# EAGLE board Wheelchair (EAGLE 5.11), part 1 of 2
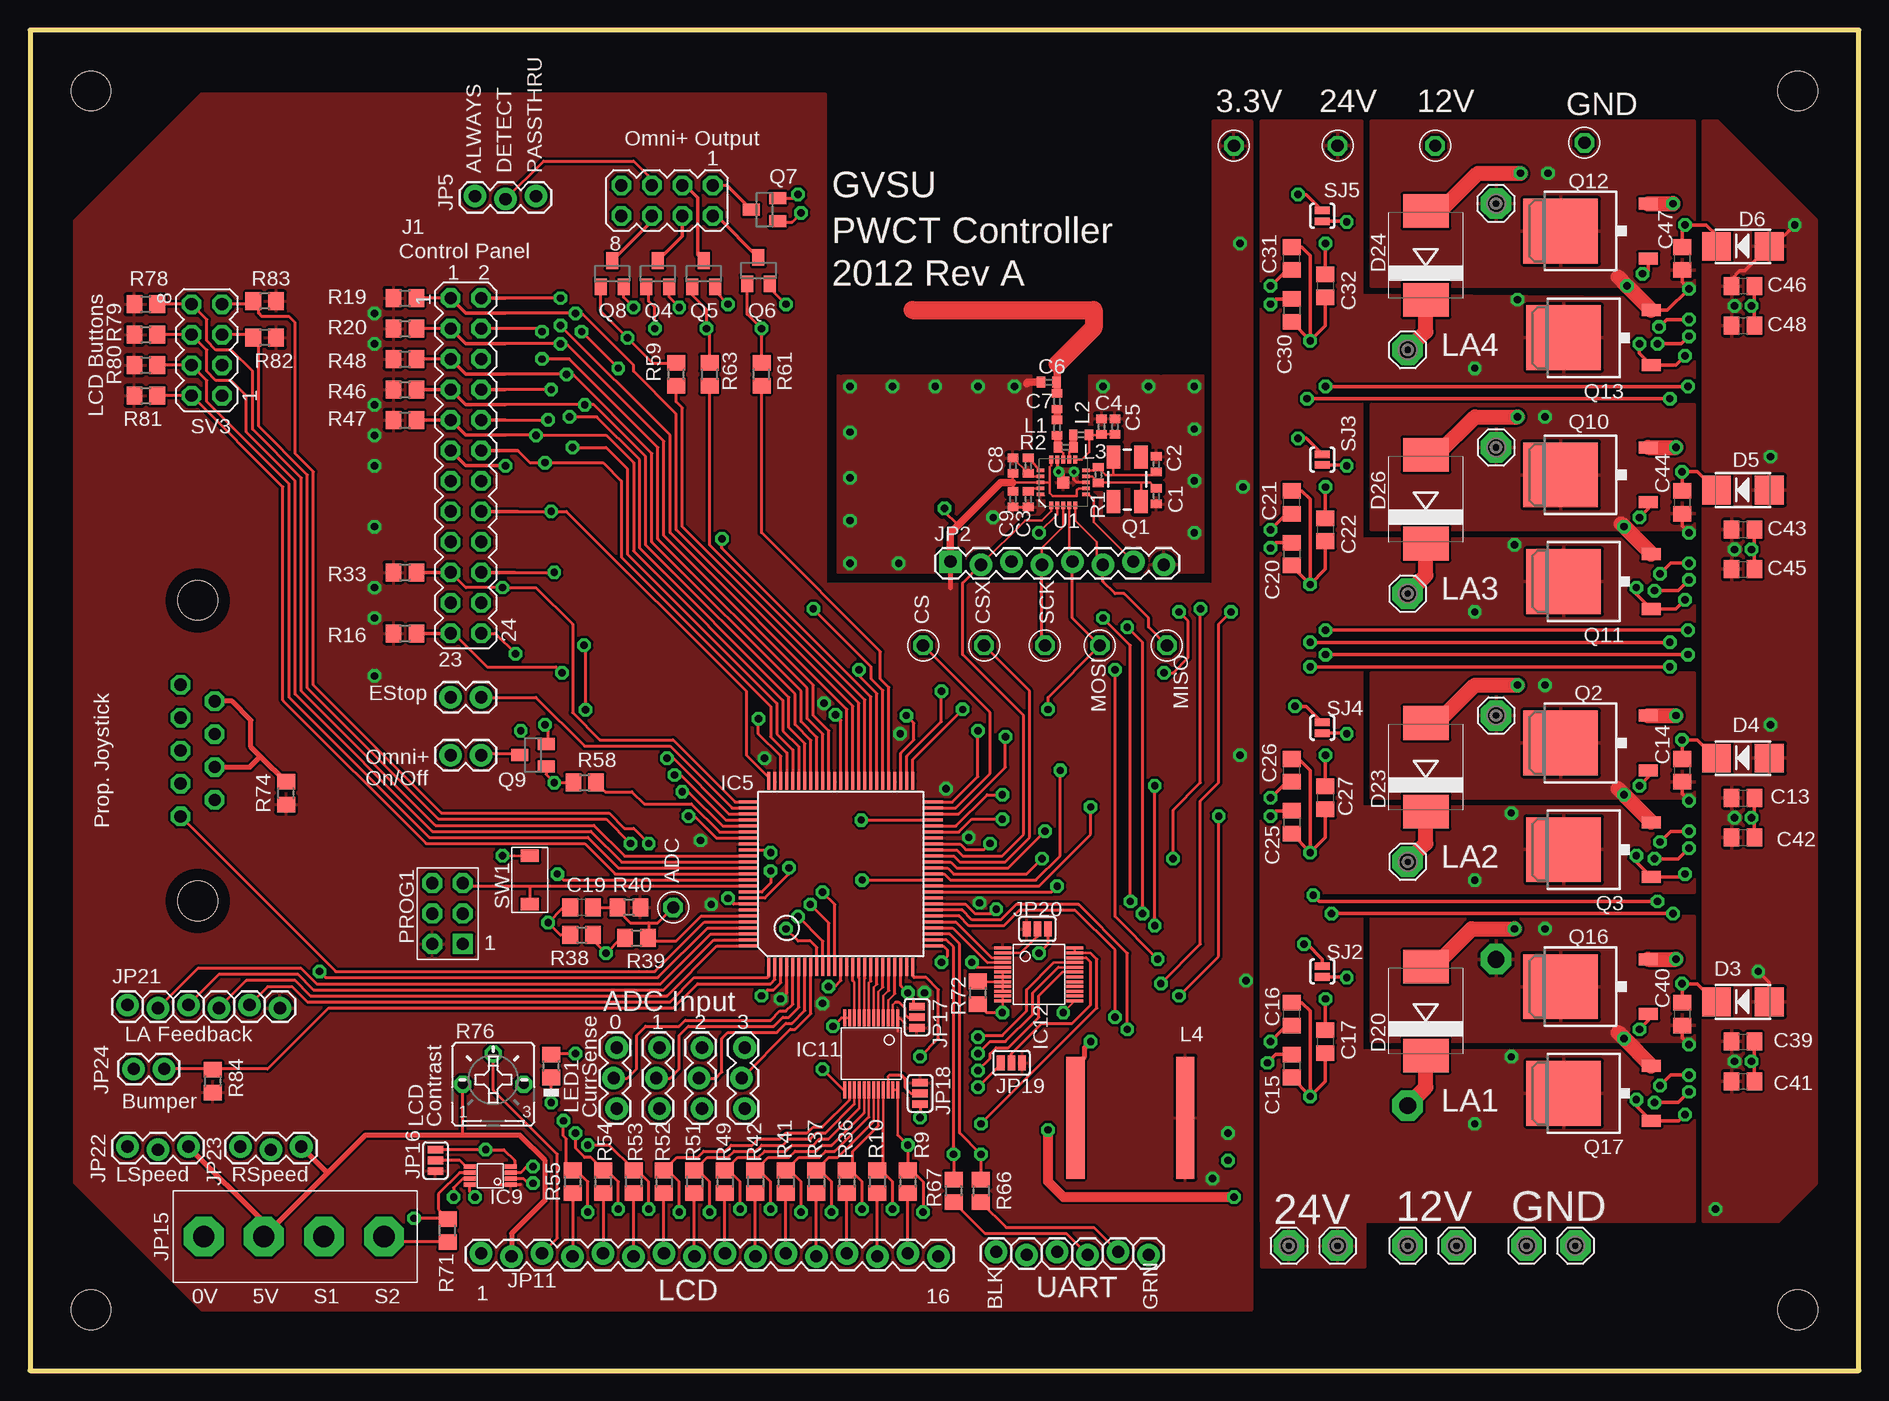
[diagram p3: board, top side]
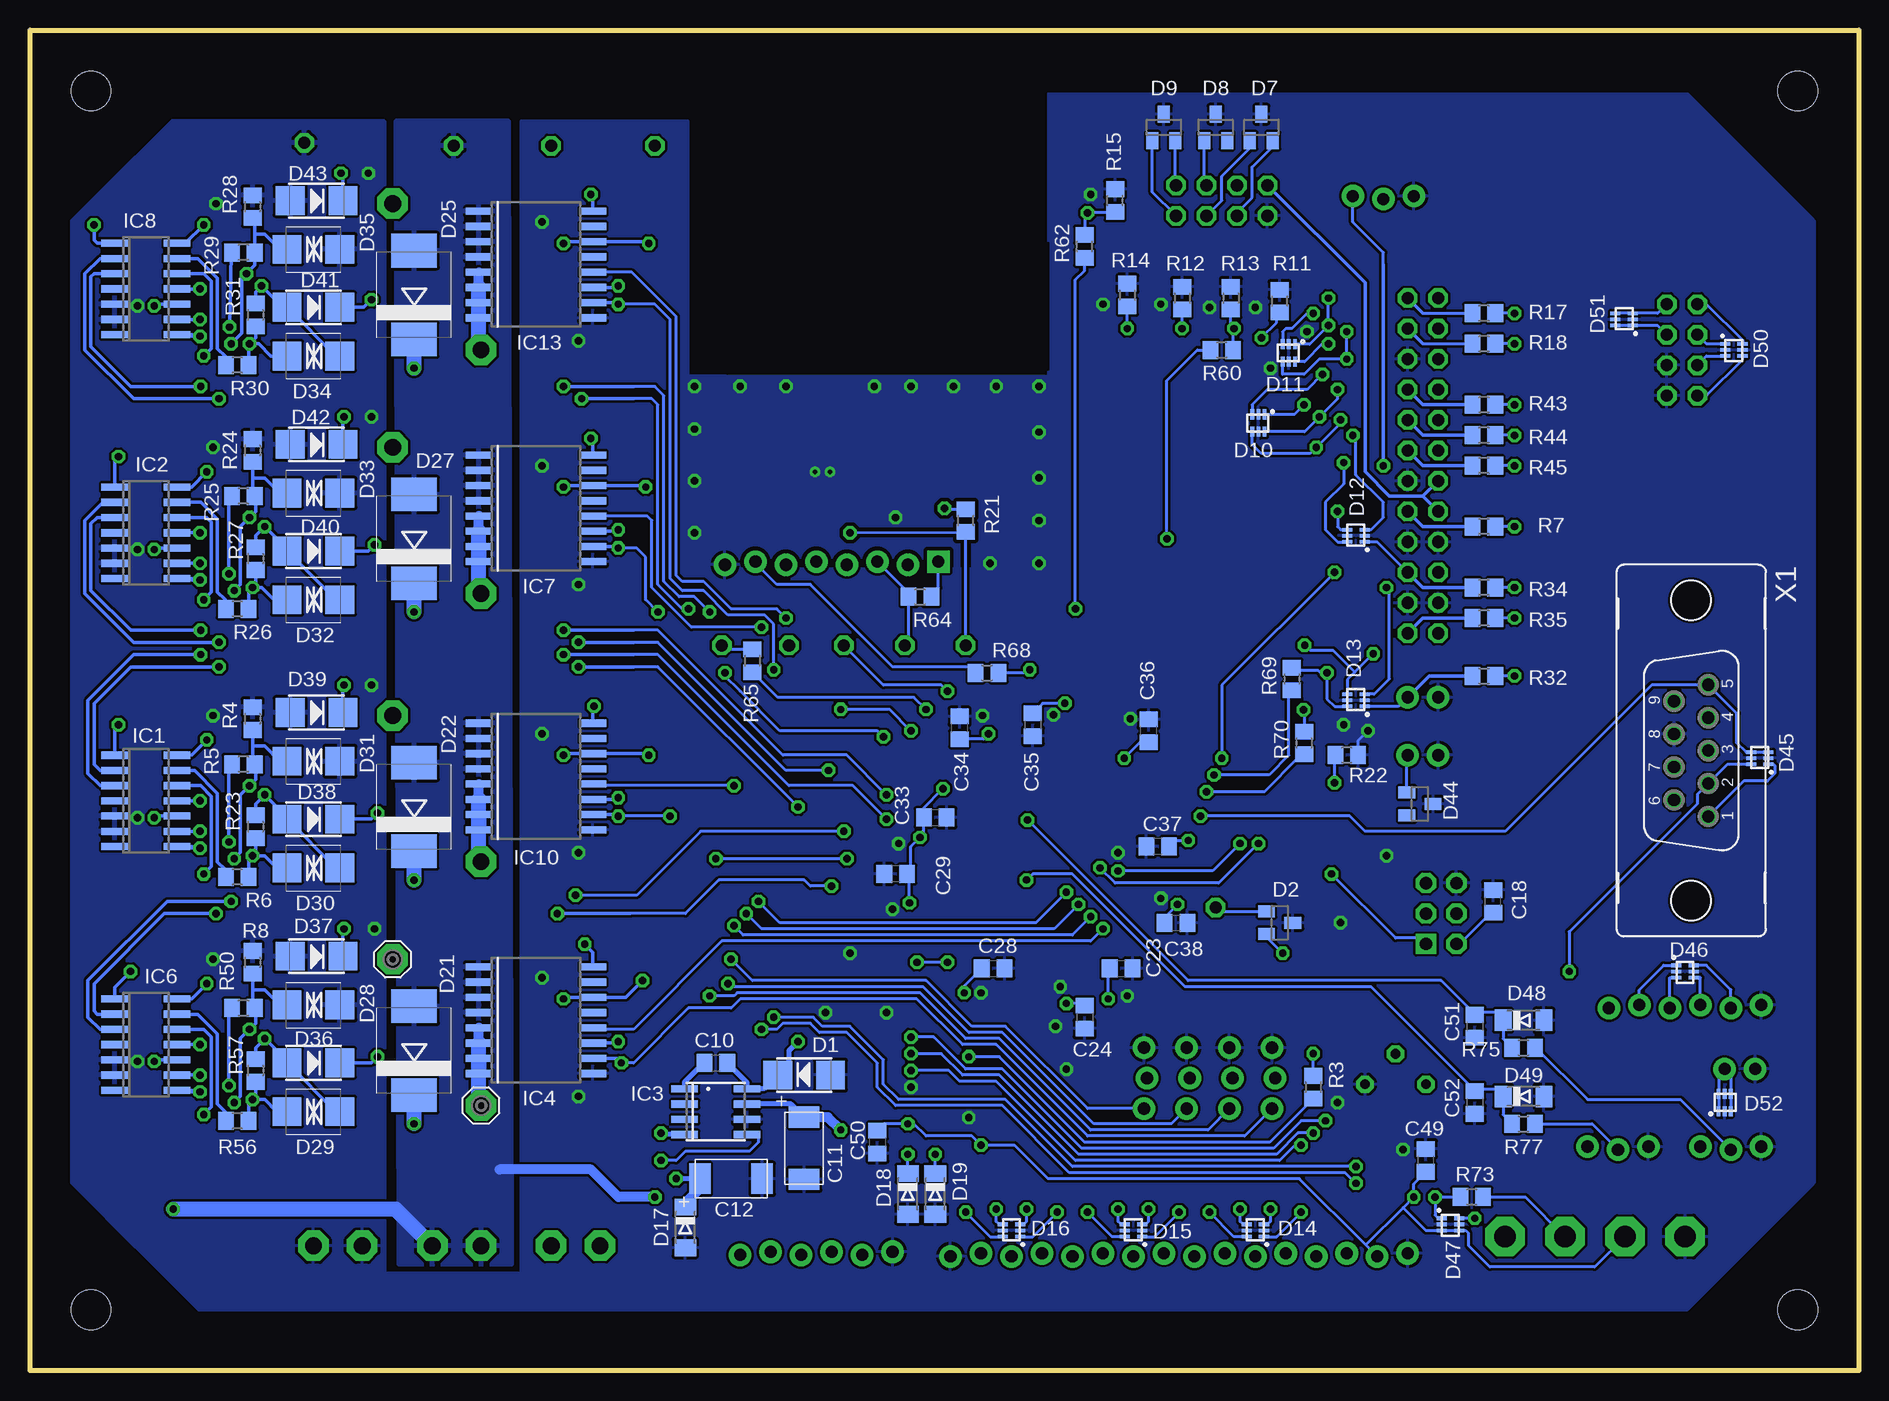
[diagram p4: board, bottom side, seen from below]

Size 152.4 x 111.76 mm. Coordinates in mm from the lower left corner, seen from the top.
Outline: 0,0 152.4,0 152.4,111.76 0,111.76 0,0
Copper layers (1*16): Top 0.035mm / dielectric 1.5mm / Bottom 0.035mm
Design rules "SparkFunmod": minimum track width 8mil, minimum drill 20mil, track to track 8mil, track to pad 8mil, pad to pad 8mil, via to via 8mil, smd to smd 8mil, copper to edge 10mil, drill to drill 8mil, minimum pad ring 12mil, minimum via ring 10mil, stop-mask expansion 4mil, vias tented up to drill 0mil, thermal gap 10mil
tRestrict: area 67.6,83.4 to 94.2,94; area 3.6,4.8 to 14.2,15.5; area 3.6,96 to 14.2,106.7; area 138.4,96 to 149.1,106.7; area 138.4,4.8 to 149.1,15.5
bRestrict: area 67.6,83.4 to 94.2,94; area 3.6,4.8 to 14.2,15.5; area 3.6,96 to 14.2,106.7; area 138.4,96 to 149.1,106.7; area 138.4,4.8 to 149.1,15.5

## Footprints (pad centres in the part's own frame; a part is rotated, then mirrored left to right if it is on the bottom)
C0402 = smd 0.7 x 0.9: 1 -0.65,0; 2 0.65,0
C0805 = smd 1.3 x 1.5: 1 -0.95,0; 2 0.95,0
CPOL2312 = smd 1.778 x 2.54: + -2.591,0; - 2.591,0
SMA = smd 2.4 x 2.4: A 2.2,0; C -2.2,0
SOT-23 = smd 1 x 1.4: 1 -0.95,-1.1; 2 0.95,-1.1; 3 0,1.1
SOT23 = smd 1 x 1.4: 1 -0.95,-1.1; 2 0.95,-1.1; 3 0,1.1
SC89 = smd 0.305 x 0.838: 1 -0.508,-0.724; 2 0,-0.724; 3 0.508,-0.724; 4 0.508,0.724; 5 0,0.724; 6 -0.508,0.724
MINIMELF = smd 1.4 x 1.8: A 1.7,0; C -1.7,0
SMC = smd 2.8 x 3.8: A 3.7,0; C -3.7,0
SMBBI = smd 2.4 x 2.4: A 2.2,0; K -2.2,0
SO14 = smd 0.6 x 2.2: 1 -3.81,-2.6; 2 -2.54,-2.6; 3 -1.27,-2.6; 4 0,-2.6; 5 1.27,-2.6; 6 2.54,-2.6; 7 3.81,-2.6; 8 3.81,2.6; 9 2.54,2.6; 10 1.27,2.6; 11 0,2.6; 12 -1.27,2.6; 13 -2.54,2.6; 14 -3.81,2.6
SOIC8_3.9MM = smd 0.6 x 2.2: 1 -1.905,-2.6; 2 -0.635,-2.6; 3 0.635,-2.6; 4 1.905,-2.6; 5 1.905,2.6; 6 0.635,2.6; 7 -0.635,2.6; 8 -1.905,2.6
SOIC16W = smd 0.6 x 2.2: 1 -4.445,-4.75; 2 -3.175,-4.75; 3 -1.905,-4.75; 4 -0.635,-4.75; 5 0.635,-4.75; 6 1.905,-4.75; 7 3.175,-4.75; 8 4.445,-4.75; 9 4.445,4.75; 10 3.175,4.75; 11 1.905,4.75; 12 0.635,4.75; 13 -0.635,4.75; 14 -1.905,4.75; 15 -3.175,4.75; 16 -4.445,4.75
TQFP100 = smd 0.27 x 1.5: 1 -6,-7.75; 2 -5.5,-7.75; 3 -5,-7.75; 4 -4.5,-7.75; 5 -4,-7.75; 6 -3.5,-7.75; 7 -3,-7.75; 8 -2.5,-7.75; 9 -2,-7.75; 10 -1.5,-7.75; 11 -1,-7.75; 12 -0.5,-7.75; 13 0,-7.75; 14 0.5,-7.75; 15 1,-7.75; 16 1.5,-7.75; 17 2,-7.75; 18 2.5,-7.75; 19 3,-7.75; 20 3.5,-7.75; 21 4,-7.75; 22 4.5,-7.75; 23 5,-7.75; 24 5.5,-7.75; 25 6,-7.75; 51 6,7.75; 52 5.5,7.75; 53 5,7.75; 54 4.5,7.75; 55 4,7.75; 56 3.5,7.75; 57 3,7.75; 58 2.5,7.75; 59 2,7.75; 60 1.5,7.75; 61 1,7.75; 62 0.5,7.75; 63 0,7.75; 64 -0.5,7.75; 65 -1,7.75; 66 -1.5,7.75; 67 -2,7.75; 68 -2.5,7.75; 69 -3,7.75; 70 -3.5,7.75; 71 -4,7.75; 72 -4.5,7.75; 73 -5,7.75; 74 -5.5,7.75; 75 -6,7.75 | smd 1.5 x 0.27: 26 7.75,-6; 27 7.75,-5.5; 28 7.75,-5; 29 7.75,-4.5; 30 7.75,-4; 31 7.75,-3.5; 32 7.75,-3; 33 7.75,-2.5; 34 7.75,-2; 35 7.75,-1.5; 36 7.75,-1; 37 7.75,-0.5; 38 7.75,0; 39 7.75,0.5; 40 7.75,1; 41 7.75,1.5; 42 7.75,2; 43 7.75,2.5; 44 7.75,3; 45 7.75,3.5; 46 7.75,4; 47 7.75,4.5; 48 7.75,5; 49 7.75,5.5; 50 7.75,6; 76 -7.75,6; 77 -7.75,5.5; 78 -7.75,5; 79 -7.75,4.5; 80 -7.75,4; 81 -7.75,3.5; 82 -7.75,3; 83 -7.75,2.5; 84 -7.75,2; 85 -7.75,1.5; 86 -7.75,1; 87 -7.75,0.5; 88 -7.75,0; 89 -7.75,-0.5; 90 -7.75,-1; 91 -7.75,-1.5; 92 -7.75,-2; 93 -7.75,-2.5; 94 -7.75,-3; 95 -7.75,-3.5; 96 -7.75,-4; 97 -7.75,-4.5; 98 -7.75,-5; 99 -7.75,-5.5; 100 -7.75,-6
VSSOP8 = smd 0.35 x 1: 1 -0.75,-1.7; 2 -0.25,-1.7; 3 0.25,-1.7; 4 0.75,-1.7; 5 0.75,1.7; 6 0.25,1.7; 7 -0.25,1.7; 8 -0.75,1.7
TVSOP24 = smd 0.25 x 1.4: 1 -2.2,-3; 2 -1.8,-3; 3 -1.4,-3; 4 -1,-3; 5 -0.6,-3; 6 -0.2,-3; 7 0.2,-3; 8 0.6,-3; 9 1,-3; 10 1.4,-3; 11 1.8,-3; 12 2.2,-3; 13 2.2,3; 14 1.8,3; 15 1.4,3; 16 1,3; 17 0.6,3; 18 0.2,3; 19 -0.2,3; 20 -0.6,3; 21 -1,3; 22 -1.4,3; 23 -1.8,3; 24 -2.2,3
1X06_LOCK = drill 1.016 pad 1.88 round: 1 0,0; 2 2.54,-0.254; 3 5.08,0; 4 7.62,-0.254; 5 10.16,0; 6 12.7,-0.254
1X08_LOCK = drill 1.016 pad 1.88 square: 1 0,0.127 | drill 1.016 pad 1.88 round: 2 2.54,-0.127; 3 5.08,0.127; 4 7.62,-0.127; 5 10.16,0.127; 6 12.7,-0.127; 7 15.24,0.127; 8 17.78,-0.127
1X02 = drill 1.016 pad 1.88 round: 1 0,0; 2 2.54,0
1X03_LOCK = drill 1.016 pad 1.88 round: 1 0,0.127; 2 2.54,-0.127; 3 5.08,0.127
STAND-OFF = hole 3.302: 0,0
1X16_LOCK = drill 1.016 pad 1.88 round: 1 0,0.127; 2 2.54,-0.127; 3 5.08,0.127; 4 7.62,-0.127; 5 10.16,0.127; 6 12.7,-0.127; 7 15.24,0.127; 8 17.78,-0.127; 9 20.32,0.127; 10 22.86,-0.127; 11 25.4,0.127; 12 27.94,-0.127; 13 30.48,0.127; 14 33.02,-0.127; 15 35.56,0.127; 16 38.1,-0.127
4PINH0.197 = drill 1.778 pad 3.302 octagon: P$1 0,0; P$2 5.004,0; P$3 10.008,0; P$4 15.011,0
SJ_3 = smd 0.635 x 1.27: 1 -0.889,0; 2 0,0; 3 0.889,0
LCI_SERIES_PULSE_EGR = smd 1.524 x 10.16: P$1 4.572,0; P$2 -4.572,0
D0805 = smd 1.3 x 1.5: A 0.95,0; C -0.95,0
SE14 = drill 1.397 pad 2.54 octagon: MP 0,0
CON6P2R = drill 1.016 pad 1.676 square: 1 -2.54,-1.27 | drill 1.016 pad 1.676 octagon: 2 -2.54,1.27; 3 0,-1.27; 4 0,1.27; 5 2.54,-1.27; 6 2.54,1.27
CRYSTAL-SMD-5X3 = smd 1.9 x 1.1: 1 -1.85,-1.15; 2 1.85,-1.15; 3 1.85,1.15; 4 -1.85,1.15
TO252 = smd 1 x 1.6: 1 -2.28,-4.8; 2 2.28,-4.8 | smd 5.4 x 6.2: 3 0,2.5
R0805 = smd 1.3 x 1.5: 1 -0.95,0; 2 0.95,0
B25P = drill 0.813 octagon: A -2.54,0; E 2.54,0; S 0,2.54
SJ_2S-NO = smd 0.635 x 1.27: 1 -0.45,0; 2 0.45,0
MA12-2 = drill 1.016 octagon: 1 -13.97,-1.27; 2 -13.97,1.27; 3 -11.43,-1.27; 4 -11.43,1.27; 5 -8.89,-1.27; 6 -8.89,1.27; 7 -6.35,-1.27; 8 -6.35,1.27; 9 -3.81,-1.27; 10 -3.81,1.27; 11 -1.27,-1.27; 12 -1.27,1.27; 13 1.27,-1.27; 14 1.27,1.27; 15 3.81,-1.27; 16 3.81,1.27; 17 6.35,-1.27; 18 6.35,1.27; 19 8.89,-1.27; 20 8.89,1.27; 21 11.43,-1.27; 22 11.43,1.27; 23 13.97,-1.27; 24 13.97,1.27
MA04-2 = drill 1.016 octagon: 1 -3.81,-1.27; 2 -3.81,1.27; 3 -1.27,-1.27; 4 -1.27,1.27; 5 1.27,-1.27; 6 1.27,1.27; 7 3.81,-1.27; 8 3.81,1.27
TL1015 = smd 1.05 x 1.5: P$1 2.025,0; P$2 -2.025,0
TP40MIL = drill 1.016 octagon: 1 0,0
QFN20 = smd 1 x 1: 0 0,0 | smd 0.65 x 0.3: 1 -1.9,1; 2 -1.9,0.5; 3 -1.9,0; 4 -1.9,-0.5; 5 -1.9,-1; 11 1.9,-1; 12 1.9,-0.5; 13 1.9,0; 14 1.9,0.5; 15 1.9,1 | smd 0.3 x 0.65: 6 -1,-1.9; 7 -0.5,-1.9; 8 0,-1.9; 9 0.5,-1.9; 10 1,-1.9; 16 1,1.9; 17 0.5,1.9; 18 0,1.9; 19 -0.5,1.9; 20 -1,1.9
F09V = drill 1.016 octagon: 1 5.486,1.422; 2 2.743,1.422; 3 0,1.422; 4 -2.743,1.422; 5 -5.486,1.422; 6 4.115,-1.422; 7 1.372,-1.422; 8 -1.372,-1.422; 9 -4.115,-1.422 | hole 3.302: -12.522,0; 12.522,0

## Placement (x,y rotation side)
C1  22pF  [C0402]  93.85,72.9 270 top
C2  22pF  [C0402]  93.85,75.57 90 top
C3  33nF  [C0402]  83.19,72.64 270 top
C4  2.2nF  [C0402]  89.3,78.7 90 top
C5  4.7pF  [C0402]  90.41,78.7 90 top
C6  1.0pF  [C0402]  84.91,82.4 0 top
C7  1.5pF  [C0402]  85.59,80.81 90 top
C8  10nF  [C0402]  81.91,75.44 270 top
C9  1nF  [C0402]  81.91,72.64 90 top
C10  0.01uF  [C0805]  95.25,25.65 0 bottom
C11  100uF  [CPOL2312]  87.88,18.54 270 bottom
C12  100uF  [CPOL2312]  93.98,16 0 bottom
C13  10uF  [C0805]  142.75,47.75 0 top
C14  1uF  [C0805]  137.67,50.04 270 top
C15  1nF  [C0805]  105.16,25.4 270 top
C16  10nF  [C0805]  105.16,29.72 90 top
C17  0.1uF  [C0805]  107.95,27.43 270 top
C18  0.1uF  [C0805]  30.48,39.12 90 bottom
C19  0.1uF  [C0805]  45.97,38.61 180 top
C20  1nF  [C0805]  105.16,68.07 270 top
C21  10nF  [C0805]  105.16,72.39 90 top
C22  0.1uF  [C0805]  107.95,70.1 270 top
C23  0.1uF  [C0805]  61.47,33.53 0 bottom
C24  0.1uF  [C0805]  64.52,29.46 270 bottom
C25  1nF  [C0805]  105.16,45.72 270 top
C26  10nF  [C0805]  105.16,50.04 90 top
C27  0.1uF  [C0805]  107.95,47.75 270 top
C28  0.1uF  [C0805]  72.14,33.53 0 bottom
C29  0.1uF  [C0805]  80.26,41.4 180 bottom
C30  1nF  [C0805]  105.16,88.39 270 top
C31  10nF  [C0805]  105.16,92.71 90 top
C32  0.1uF  [C0805]  107.95,90.42 270 top
C33  0.1uF  [C0805]  76.96,46.1 0 bottom
C34  0.1uF  [C0805]  74.93,53.59 90 bottom
C35  0.1uF  [C0805]  68.83,53.85 270 bottom
C36  0.1uF  [C0805]  59.18,53.34 90 bottom
C37  0.1uF  [C0805]  58.42,43.69 180 bottom
C38  0.1uF  [C0805]  56.9,37.34 0 bottom
C39  10uF  [C0805]  142.75,27.43 0 top
C40  1uF  [C0805]  137.67,29.72 270 top
C41  0.1uF  [C0805]  142.75,24.13 0 top
C42  0.1uF  [C0805]  142.75,44.45 0 top
C43  10uF  [C0805]  142.75,70.1 0 top
C44  1uF  [C0805]  137.67,72.39 270 top
C45  0.1uF  [C0805]  142.75,66.8 0 top
C46  10uF  [C0805]  142.75,90.42 0 top
C47  1uF  [C0805]  137.67,92.71 270 top
C48  0.1uF  [C0805]  142.75,87.12 0 top
C49  0.1uF  [C0805]  36.07,17.53 90 bottom
C50  0.1uF  [C0805]  81.79,19.05 270 bottom
C51  1nF  [C0805]  32,28.7 270 bottom
C52  1nF  [C0805]  32,22.35 270 bottom
D1  [SMA]  87.88,24.64 0 bottom
D2  TL431SOT23  [SOT-23]  48.26,37.34 270 bottom
D3  [SMA]  142.75,30.73 0 top
D4  [SMA]  142.75,51.05 0 top
D5  [SMA]  142.75,73.41 0 top
D6  [SMA]  142.75,93.73 0 top
D7  ZENER_COMMON_ANODE  [SOT23]  49.78,103.63 0 bottom
D8  ZENER_COMMON_ANODE  [SOT23]  53.59,103.63 0 bottom
D9  ZENER_COMMON_ANODE  [SOT23]  57.91,103.63 0 bottom
D10  TVS4  [SC89]  50.04,78.99 180 bottom
D11  TVS4  [SC89]  47.5,84.84 180 bottom
D12  TVS4  [SC89]  41.91,69.6 90 bottom
D13  TVS4  [SC89]  41.91,55.88 90 bottom
D14  TVS4  [SC89]  50.29,11.68 90 bottom
D15  TVS4  [SC89]  60.45,11.68 90 bottom
D16  TVS4  [SC89]  70.61,11.68 90 bottom
D17  3.3V  [MINIMELF]  97.79,11.94 270 bottom
D18  3.3V  [MINIMELF]  79.25,14.73 270 bottom
D19  3.3V  [MINIMELF]  76.96,14.73 270 bottom
D20  [SMC]  116.33,29.97 90 top
D21  [SMC]  120.4,26.67 90 bottom
D22  [SMC]  120.4,46.99 90 bottom
D23  [SMC]  116.33,50.29 90 top
D24  [SMC]  116.33,92.96 90 top
D25  [SMC]  120.4,89.66 90 bottom
D26  [SMC]  116.33,72.64 90 top
D27  [SMC]  120.4,69.34 90 bottom
D28  [SMBBI]  128.78,30.48 0 bottom
D29  [SMBBI]  128.78,21.59 0 bottom
D30  [SMBBI]  128.78,41.91 0 bottom
D31  [SMBBI]  128.78,50.8 0 bottom
D32  [SMBBI]  128.78,64.26 0 bottom
D33  [SMBBI]  128.78,73.15 0 bottom
D34  [SMBBI]  128.78,84.58 0 bottom
D35  [SMBBI]  128.78,93.47 0 bottom
D36  TVSSMA  [SMA]  128.78,25.65 180 bottom
D37  TVSSMA  [SMA]  128.52,34.54 180 bottom
D38  TVSSMA  [SMA]  128.78,45.97 180 bottom
D39  TVSSMA  [SMA]  128.52,54.86 180 bottom
D40  TVSSMA  [SMA]  128.78,68.33 180 bottom
D41  TVSSMA  [SMA]  128.78,88.65 180 bottom
D42  TVSSMA  [SMA]  128.52,77.22 180 bottom
D43  TVSSMA  [SMA]  128.52,97.54 180 bottom
D44  ZENER_COMMON_ANODE  [SOT23]  36.58,47.24 270 bottom
D45  TVS4  [SC89]  8.26,51.05 90 bottom
D46  TVS4  [SC89]  14.48,33.27 270 bottom
D47  TVS4  [SC89]  34.04,12.19 270 bottom
D48  3.3V  [MINIMELF]  27.94,29.21 0 bottom
D49  3.3V  [MINIMELF]  27.94,22.86 0 bottom
D50  TVS4  [SC89]  10.41,85.09 270 bottom
D51  TVS4  [SC89]  19.56,87.63 90 bottom
D52  TVS4  [SC89]  11.18,22.35 0 bottom
IC1  LT1160  [SO14]  142.75,47.5 270 bottom
IC2  LT1160  [SO14]  142.75,69.85 270 bottom
IC3  LM2674M  [SOIC8_3.9MM]  95.25,21.59 270 bottom
IC4  ACS716  [SOIC16W]  110.24,29.21 270 bottom
IC5  ATXMEGA_A1  [TQFP100]  67.56,41.4 0 top
IC6  LT1160  [SO14]  142.75,27.18 270 bottom
IC7  ACS716  [SOIC16W]  110.24,71.88 270 bottom
IC8  LT1160  [SO14]  142.75,90.17 270 bottom
IC9  74LVC2T45  [VSSOP8]  38.35,16.26 90 top
IC10  ACS716  [SOIC16W]  110.24,49.53 270 bottom
IC11  SN74LVC8T245DGVR  [TVSOP24]  70.1,26.42 180 top
IC12  SN74LVC8T245DGVR  [TVSOP24]  84.07,33.02 270 top
IC13  ACS716  [SOIC16W]  110.24,92.2 270 bottom
JP1  [1X06_LOCK]  80.52,9.91 0 top
JP2  [1X08_LOCK]  76.71,67.31 0 top
JP3  [1X02]  37.59,56.13 180 top
JP4  [1X02]  37.59,51.31 180 top
JP5  [1X03_LOCK]  37.08,97.79 0 top
JP6  [1X03_LOCK]  48.77,26.92 270 top
JP7  [1X03_LOCK]  52.32,26.92 270 top
JP8  [1X03_LOCK]  55.88,26.92 270 top
JP9  [1X03_LOCK]  59.44,26.92 270 top
JP10  STAND-OFF  [STAND-OFF]  5.08,5.08 0 top
JP11  M16LOCK  [1X16_LOCK]  37.59,9.65 0 top
JP12  STAND-OFF  [STAND-OFF]  147.32,5.08 0 top
JP13  STAND-OFF  [STAND-OFF]  147.32,106.68 0 top
JP14  STAND-OFF  [STAND-OFF]  5.08,106.68 0 top
JP15  4PINH0.197  [4PINH0.197]  14.48,11.18 0 top
JP16  JUMPER-3SMD  [SJ_3]  33.78,17.53 270 top
JP17  JUMPER-3SMD  [SJ_3]  73.91,29.46 270 top
JP18  JUMPER-3SMD  [SJ_3]  74.17,23.11 270 top
JP19  JUMPER-3SMD  [SJ_3]  81.79,25.65 180 top
JP20  JUMPER-3SMD  [SJ_3]  83.95,36.83 0 top
JP21  [1X06_LOCK]  8.13,30.48 0 top
JP22  [1X03_LOCK]  8.13,18.54 0 top
JP23  [1X03_LOCK]  17.53,18.54 0 top
JP24  [1X02]  11.18,25.15 180 top
L1  3.9nH  [C0402]  85.59,78.61 90 top
L2  2.7nH  [C0402]  87.59,78.01 180 top
L3  8.2nH  [C0402]  86.31,76.96 180 top
L4  118uH  [LCI_SERIES_PULSE_EGR]  91.69,21.08 180 top
LED1  blue  [D0805]  43.43,25.4 90 top
LSP1  SE14  [SE14]  114.81,10.41 0 top
LSP2  SE14  [SE14]  104.9,10.41 0 top
LSP3  SE14  [SE14]  114.81,22.1 180 bottom
LSP4  SE14  [SE14]  108.97,10.41 0 top
LSP5  SE14  [SE14]  118.87,10.41 0 top
LSP6  SE14  [SE14]  124.71,10.41 0 top
LSP7  SE14  [SE14]  122.17,34.29 180 bottom
LSP8  SE14  [SE14]  128.78,10.41 0 top
LSP17  SE14  [SE14]  114.81,64.77 0 top
LSP18  SE14  [SE14]  122.17,76.96 0 top
LSP19  SE14  [SE14]  114.81,42.42 0 top
LSP20  SE14  [SE14]  122.17,54.61 0 top
LSP21  SE14  [SE14]  114.81,85.09 270 top
LSP22  SE14  [SE14]  122.17,97.28 270 top
PROG1  AVR_ISP_PDI  [CON6P2R]  34.8,38.1 90 top
Q1  16MHz  [CRYSTAL-SMD-5X3]  91.44,74.3 90 top
Q2  MOSFET-NTO252  [TO252]  130.05,52.32 90 top
Q3  MOSFET-NTO252  [TO252]  130.3,43.43 90 top
Q4  MOSFET-N.SOT23  [SOT-23]  52.32,91.44 0 top
Q5  MOSFET-N.SOT23  [SOT-23]  56.13,91.44 0 top
Q6  MOSFET-N.SOT23  [SOT-23]  60.71,91.69 0 top
Q7  MOSFET-N.SOT23  [SOT-23]  61.21,96.77 90 top
Q8  MOSFET-N.SOT23  [SOT-23]  48.51,91.44 0 top
Q9  MOSFET-N.SOT23  [SOT-23]  41.91,51.31 90 top
Q10  MOSFET-NTO252  [TO252]  130.05,74.68 90 top
Q11  MOSFET-NTO252  [TO252]  130.3,65.79 90 top
Q12  MOSFET-NTO252  [TO252]  130.05,95 90 top
Q13  MOSFET-NTO252  [TO252]  130.3,86.11 90 top
Q16  MOSFET-NTO252  [TO252]  130.05,32 90 top
Q17  MOSFET-NTO252  [TO252]  130.3,23.11 90 top
R1  1M  [C0402]  89.03,74.68 90 top
R2  22K  [C0402]  83.19,75.44 270 top
R3  40  [R0805]  45.47,23.62 270 bottom
R4  10k  [R0805]  133.86,54.36 270 bottom
R5  15  [R0805]  134.62,50.55 180 bottom
R6  15  [R0805]  135.13,41.15 180 bottom
R7  10k  [R0805]  31.24,70.36 180 bottom
R8  10k  [R0805]  133.86,34.04 270 bottom
R9  0  [R0805]  73.15,15.75 270 top
R10  10k  [R0805]  70.61,15.75 270 top
R11  10k  [R0805]  48.26,89.15 90 bottom
R12  10k  [R0805]  56.39,89.41 270 bottom
R13  10k  [R0805]  52.32,89.41 270 bottom
R14  10k  [R0805]  60.96,89.66 270 bottom
R15  10k  [R0805]  61.98,97.54 90 bottom
R16  145  [R0805]  31.24,61.47 0 top
R17  10k  [R0805]  31.24,88.14 180 bottom
R18  10k  [R0805]  31.24,85.6 180 bottom
R19  10k  [R0805]  31.24,89.41 0 top
R20  10k  [R0805]  31.24,86.87 0 top
R21  100k  [R0805]  74.42,70.87 90 bottom
R22  10k  [R0805]  42.67,51.31 180 bottom
R23  10k  [R0805]  133.6,45.34 270 bottom
R24  10k  [R0805]  133.86,76.71 270 bottom
R25  15  [R0805]  134.62,72.9 180 bottom
R26  15  [R0805]  135.13,63.5 180 bottom
R27  10k  [R0805]  133.6,67.69 270 bottom
R28  10k  [R0805]  133.86,97.03 270 bottom
R29  15  [R0805]  134.62,93.22 180 bottom
R30  15  [R0805]  135.13,83.82 180 bottom
R31  10k  [R0805]  133.6,88.01 270 bottom
R32  10k  [R0805]  31.24,57.91 0 bottom
R33  10k  [R0805]  31.24,66.55 0 top
R34  10k  [R0805]  31.24,65.28 180 bottom
R35  110  [R0805]  31.24,62.74 180 bottom
R36  10k  [R0805]  68.07,15.75 270 top
R37  10k  [R0805]  65.53,15.75 270 top
R38  12.5k  [R0805]  45.97,36.32 0 top
R39  1k  [R0805]  50.55,36.07 0 top
R40  400  [R0805]  49.91,38.61 180 top
R41  10k  [R0805]  62.99,15.75 270 top
R42  10k  [R0805]  60.45,15.75 270 top
R43  100k  [R0805]  31.24,80.52 180 bottom
R44  100k  [R0805]  31.24,77.98 180 bottom
R45  100k  [R0805]  31.24,75.44 180 bottom
R46  100k  [R0805]  31.24,81.79 0 top
R47  100k  [R0805]  31.24,79.25 0 top
R48  10k  [R0805]  31.24,84.33 0 top
R49  10k  [R0805]  57.91,15.75 270 top
R50  15  [R0805]  134.62,30.23 180 bottom
R51  10k  [R0805]  55.37,15.75 270 top
R52  10k  [R0805]  52.83,15.75 270 top
R53  10k  [R0805]  50.29,15.75 270 top
R54  10k  [R0805]  47.75,15.75 270 top
R55  10k  [R0805]  45.21,15.75 270 top
R56  15  [R0805]  135.13,20.83 180 bottom
R57  10k  [R0805]  133.6,25.02 270 bottom
R58  220  [R0805]  46.23,49.02 0 top
R59  220  [R0805]  53.85,83.06 90 top
R60  220  [R0805]  53.09,85.09 0 bottom
R61  220  [R0805]  60.96,83.06 90 top
R62  220  [R0805]  64.52,93.73 90 bottom
R63  220  [R0805]  56.64,83.06 90 top
R64  100k  [R0805]  78.23,64.52 0 bottom
R65  10k  [R0805]  92.2,59.18 270 bottom
R66  10k  [R0805]  79.25,14.99 270 top
R67  10k  [R0805]  76.96,14.99 270 top
R68  10k  [R0805]  72.64,58.17 0 bottom
R69  40  [R0805]  47.24,57.66 270 bottom
R70  40  [R0805]  46.23,52.32 270 bottom
R71  1k  [R0805]  34.8,11.68 90 top
R72  10k  [R0805]  78.99,31.5 90 top
R73  1k  [R0805]  32.26,14.48 180 bottom
R74  0  [R0805]  21.34,48.13 90 top
R75  10k  [R0805]  27.94,26.92 0 bottom
R76  [B25P]  38.61,23.88 0 top
R77  10k  [R0805]  27.94,20.57 0 bottom
R78  10k  [R0805]  9.65,88.9 0 top
R79  10k  [R0805]  9.65,86.36 0 top
R80  10k  [R0805]  9.65,83.82 0 top
R81  10k  [R0805]  9.65,81.28 0 top
R82  10k  [R0805]  19.56,86.11 180 top
R83  10k  [R0805]  19.56,89.15 180 top
R84  10k  [R0805]  15.24,24.13 90 top
SJ2  SOLDERJUMPERNO  [SJ_2S-NO]  107.7,33.27 270 top
SJ3  SOLDERJUMPERNO  [SJ_2S-NO]  107.7,75.95 270 top
SJ4  SOLDERJUMPERNO  [SJ_2S-NO]  107.7,53.59 270 top
SJ5  SOLDERJUMPERNO  [SJ_2S-NO]  107.7,96.27 270 top
SV1  [MA12-2]  36.32,75.44 270 top
SV2  [MA04-2]  53.09,97.54 180 top
SV3  [MA04-2]  14.73,85.09 90 top
SW1  [TL1015]  41.66,40.89 90 top
T1  [TP40MIL]  79.5,60.45 0 top
T2  [TP40MIL]  84.58,60.45 0 top
T3  [TP40MIL]  89.15,60.45 0 top
T4  [TP40MIL]  94.74,60.45 0 top
T5  [TP40MIL]  53.59,38.61 0 top
T6  [TP40MIL]  100.33,102.11 0 top
T7  [TP40MIL]  129.54,102.36 0 top
T8  [TP40MIL]  117.09,102.11 0 top
T9  [TP40MIL]  108.97,102.11 0 top
T10  [TP40MIL]  74.42,60.45 0 top
U1  NRF24L01SMD  [QFN20]  86.11,74.04 90 top
X1  [F09V]  13.97,51.69 270 bottom